# Altium schematic sheet Buttons.SchDoc
size A4
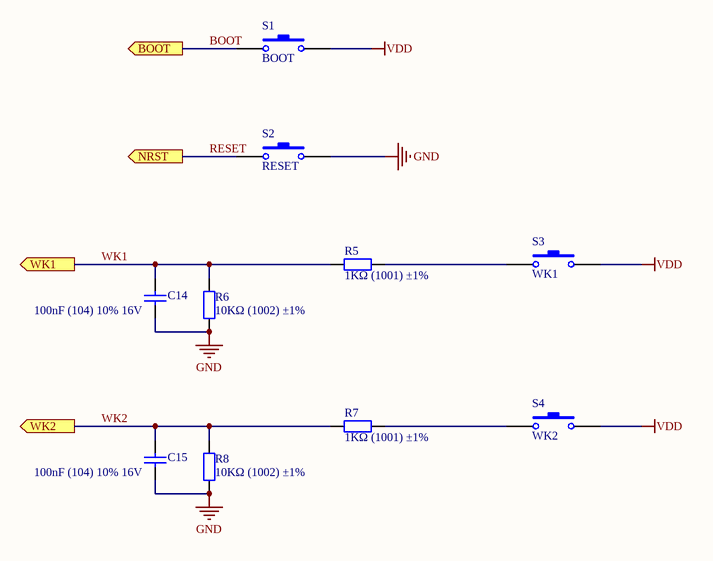
[diagram p0: Buttons.SchDoc]

## Parts
C14  100nF (104) 10% 16V  [0402_C]
C15  100nF (104) 10% 16V  [0402_C]
R5  1KΩ (1001) ±1%  [0402_R]
R6  10KΩ (1002) ±1%  [0402_R]
R7  1KΩ (1001) ±1%  [0402_R]
R8  10KΩ (1002) ±1%  [0402_R]
S1  BOOT  [SW-6x6]
S2  RESET  [SW-6x6]
S3  WK1  [SW-6x6]
S4  WK2  [SW-6x6]

## Ports
BOOT (out), NRST (out), WK1 (out), WK2 (out)

## Nets
GND: C14.1 C15.1 R6.1 R8.1 S2.2
VDD: S1.2 S3.2 S4.2
BOOT: S1.1 ; port BOOT
RESET: S2.1 ; port NRST
WK1: C14.2 R5.1 R6.2 ; port WK1
WK2: C15.2 R7.1 R8.2 ; port WK2
NetR5_2: R5.2 S3.1
NetR7_2: R7.2 S4.1

## Library data of the parts
C14 C15 = 0402 100nF (104) 10% 16V: 贴片电容; ComponentLink1Description: 供应商链接; ComponentLink1URL: http://www.szlcsc.com/product/details_1877.html; Package: 0402; Supplier: LC; SuppliersPartNumber: C1525
R5 R7 = 0402 1KΩ (1001) 1%: 贴片电阻; ComponentLink1Description: 供应商链接; ComponentLink1URL: http://www.szlcsc.com/product/details_12256.html; Package: 0402; Supplier: LC; SuppliersPartNumber: C11702
R6 R8 = 0402 10KΩ (1002) 1%: 贴片电阻; ComponentLink1Description: 供应商链接; ComponentLink1URL: http://www.szlcsc.com/product/details_26487.html; Package: 0402; Supplier: LC; SuppliersPartNumber: C25744
S1-S4 = SW-PB: Switch; Published: 24-Mar-1999; LatestRevisionDate: 17-Jul-2002; LatestRevisionNote: Re-released for DXP Platform.; PackageReference: SPST-2; Publisher: Altium Limited; PackageDescription: Switch; 2 Leads